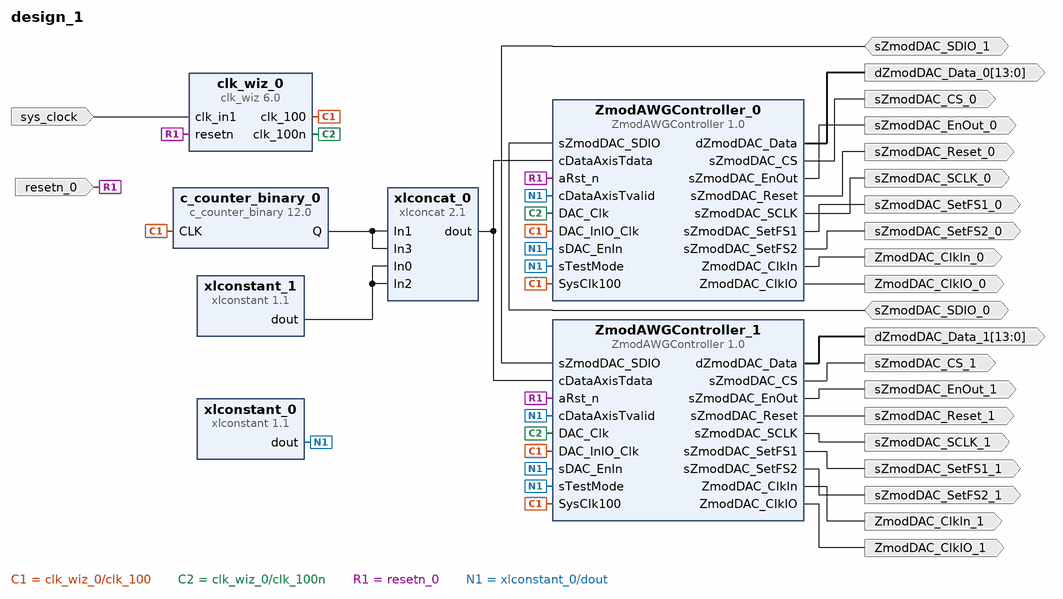
[diagram p0: block diagram of the top level]
# Vivado block design design_1, xc7z020clg484-1, Vivado 2021.2
create_bd_design design_1

create_bd_port -dir O sZmodDAC_SetFS1_0
create_bd_port -dir O -type clk ZmodDAC_ClkIO_0
create_bd_port -dir O -type clk ZmodDAC_ClkIn_0
create_bd_port -dir O -from 13 -to 0 dZmodDAC_Data_0
create_bd_port -dir IO sZmodDAC_SDIO_0
create_bd_port -dir O -type rst sZmodDAC_Reset_0
create_bd_port -dir O sZmodDAC_CS_0
create_bd_port -dir O sZmodDAC_SCLK_0
create_bd_port -dir O sZmodDAC_SetFS2_0
create_bd_port -dir O sZmodDAC_EnOut_0
create_bd_port -dir I -type clk sys_clock
set_property -dict {CONFIG.FREQ_HZ 125000000 CONFIG.PHASE 0.0} [get_bd_ports sys_clock]
create_bd_port -dir O -type clk ZmodDAC_ClkIO_1
create_bd_port -dir O -type clk ZmodDAC_ClkIn_1
create_bd_port -dir O -from 13 -to 0 dZmodDAC_Data_1
create_bd_port -dir O sZmodDAC_CS_1
create_bd_port -dir O sZmodDAC_EnOut_1
create_bd_port -dir O -type rst sZmodDAC_Reset_1
create_bd_port -dir O sZmodDAC_SCLK_1
create_bd_port -dir IO sZmodDAC_SDIO_1
create_bd_port -dir O sZmodDAC_SetFS1_1
create_bd_port -dir O sZmodDAC_SetFS2_1
create_bd_port -dir I -type rst resetn_0

create_bd_cell -type ip -vlnv digilent.com:user:ZmodAWGController:1.0 ZmodAWGController_0
set_property -dict {CONFIG.kCh1ScaleStatic {"1"}} [get_bd_cells ZmodAWGController_0]
create_bd_cell -type ip -vlnv xilinx.com:ip:xlconstant:1.1 xlconstant_0
create_bd_cell -type ip -vlnv xilinx.com:ip:clk_wiz:6.0 clk_wiz_0
set_property -dict [list \
  CONFIG.CLKOUT2_JITTER 124.615 \
  CONFIG.CLKOUT2_PHASE_ERROR 96.948 \
  CONFIG.CLKOUT2_REQUESTED_PHASE 90.000 \
  CONFIG.CLKOUT2_USED true \
  CONFIG.CLK_IN1_BOARD_INTERFACE sys_clock \
  CONFIG.CLK_OUT1_PORT clk_100 \
  CONFIG.CLK_OUT2_PORT clk_100n \
  CONFIG.MMCM_CLKOUT1_DIVIDE 10 \
  CONFIG.MMCM_CLKOUT1_PHASE 90.000 \
  CONFIG.NUM_OUT_CLKS 2 \
  CONFIG.RESET_PORT resetn \
  CONFIG.RESET_TYPE ACTIVE_LOW \
  CONFIG.USE_BOARD_FLOW true \
  CONFIG.USE_LOCKED false \
] [get_bd_cells clk_wiz_0]
create_bd_cell -type ip -vlnv digilent.com:user:ZmodAWGController:1.0 ZmodAWGController_1
set_property -dict {CONFIG.kCh1ScaleStatic {"1"}} [get_bd_cells ZmodAWGController_1]
create_bd_cell -type ip -vlnv xilinx.com:ip:xlconcat:2.1 xlconcat_0
set_property -dict {CONFIG.NUM_PORTS 4} [get_bd_cells xlconcat_0]
create_bd_cell -type ip -vlnv xilinx.com:ip:xlconstant:1.1 xlconstant_1
set_property -dict {CONFIG.CONST_VAL 0 CONFIG.CONST_WIDTH 2} [get_bd_cells xlconstant_1]
create_bd_cell -type ip -vlnv xilinx.com:ip:c_counter_binary:12.0 c_counter_binary_0
set_property -dict {CONFIG.Output_Width 14} [get_bd_cells c_counter_binary_0]

# ---- connections ----

connect_bd_net [get_bd_ports sZmodDAC_SDIO_0] [get_bd_pins ZmodAWGController_0/sZmodDAC_SDIO]
connect_bd_net [get_bd_ports sZmodDAC_SDIO_1] [get_bd_pins ZmodAWGController_1/sZmodDAC_SDIO]
connect_bd_net [get_bd_pins ZmodAWGController_0/ZmodDAC_ClkIO] [get_bd_ports ZmodDAC_ClkIO_0]
connect_bd_net -net ZmodAWGController_0_ZmodDAC_ClkIO1 [get_bd_pins ZmodAWGController_1/ZmodDAC_ClkIO] [get_bd_ports ZmodDAC_ClkIO_1]
connect_bd_net [get_bd_pins ZmodAWGController_0/ZmodDAC_ClkIn] [get_bd_ports ZmodDAC_ClkIn_0]
connect_bd_net -net ZmodAWGController_0_ZmodDAC_ClkIn1 [get_bd_pins ZmodAWGController_1/ZmodDAC_ClkIn] [get_bd_ports ZmodDAC_ClkIn_1]
connect_bd_net [get_bd_pins ZmodAWGController_0/dZmodDAC_Data] [get_bd_ports dZmodDAC_Data_0]
connect_bd_net -net ZmodAWGController_0_dZmodDAC_Data1 [get_bd_pins ZmodAWGController_1/dZmodDAC_Data] [get_bd_ports dZmodDAC_Data_1]
connect_bd_net [get_bd_pins ZmodAWGController_0/sZmodDAC_CS] [get_bd_ports sZmodDAC_CS_0]
connect_bd_net -net ZmodAWGController_0_sZmodDAC_CS1 [get_bd_pins ZmodAWGController_1/sZmodDAC_CS] [get_bd_ports sZmodDAC_CS_1]
connect_bd_net [get_bd_pins ZmodAWGController_0/sZmodDAC_EnOut] [get_bd_ports sZmodDAC_EnOut_0]
connect_bd_net -net ZmodAWGController_0_sZmodDAC_EnOut1 [get_bd_pins ZmodAWGController_1/sZmodDAC_EnOut] [get_bd_ports sZmodDAC_EnOut_1]
connect_bd_net [get_bd_pins ZmodAWGController_0/sZmodDAC_Reset] [get_bd_ports sZmodDAC_Reset_0]
connect_bd_net -net ZmodAWGController_0_sZmodDAC_Reset1 [get_bd_pins ZmodAWGController_1/sZmodDAC_Reset] [get_bd_ports sZmodDAC_Reset_1]
connect_bd_net [get_bd_pins ZmodAWGController_0/sZmodDAC_SCLK] [get_bd_ports sZmodDAC_SCLK_0]
connect_bd_net -net ZmodAWGController_0_sZmodDAC_SCLK1 [get_bd_pins ZmodAWGController_1/sZmodDAC_SCLK] [get_bd_ports sZmodDAC_SCLK_1]
connect_bd_net [get_bd_pins ZmodAWGController_0/sZmodDAC_SetFS1] [get_bd_ports sZmodDAC_SetFS1_0]
connect_bd_net [get_bd_pins ZmodAWGController_0/sZmodDAC_SetFS2] [get_bd_ports sZmodDAC_SetFS2_0]
connect_bd_net -net ZmodAWGController_0_sZmodDAC_SetFS3 [get_bd_pins ZmodAWGController_1/sZmodDAC_SetFS1] [get_bd_ports sZmodDAC_SetFS1_1]
connect_bd_net -net ZmodAWGController_0_sZmodDAC_SetFS4 [get_bd_pins ZmodAWGController_1/sZmodDAC_SetFS2] [get_bd_ports sZmodDAC_SetFS2_1]
connect_bd_net [get_bd_pins c_counter_binary_0/Q] [get_bd_pins xlconcat_0/In1] [get_bd_pins xlconcat_0/In3]
connect_bd_net [get_bd_pins clk_wiz_0/clk_100] \
  [get_bd_pins ZmodAWGController_0/SysClk100] [get_bd_pins ZmodAWGController_0/DAC_InIO_Clk] \
  [get_bd_pins ZmodAWGController_1/SysClk100] [get_bd_pins ZmodAWGController_1/DAC_InIO_Clk] \
  [get_bd_pins c_counter_binary_0/CLK]
connect_bd_net [get_bd_pins clk_wiz_0/clk_100n] [get_bd_pins ZmodAWGController_0/DAC_Clk] [get_bd_pins ZmodAWGController_1/DAC_Clk]
connect_bd_net -net resetn_0_1 [get_bd_ports resetn_0] \
  [get_bd_pins clk_wiz_0/resetn] [get_bd_pins ZmodAWGController_1/aRst_n] [get_bd_pins ZmodAWGController_0/aRst_n]
connect_bd_net [get_bd_ports sys_clock] [get_bd_pins clk_wiz_0/clk_in1]
connect_bd_net [get_bd_pins xlconcat_0/dout] [get_bd_pins ZmodAWGController_1/cDataAxisTdata] [get_bd_pins ZmodAWGController_0/cDataAxisTdata]
connect_bd_net [get_bd_pins xlconstant_0/dout] \
  [get_bd_pins ZmodAWGController_0/sDAC_EnIn] [get_bd_pins ZmodAWGController_0/sTestMode] \
  [get_bd_pins ZmodAWGController_1/sDAC_EnIn] [get_bd_pins ZmodAWGController_1/sTestMode] \
  [get_bd_pins ZmodAWGController_1/cDataAxisTvalid] [get_bd_pins ZmodAWGController_0/cDataAxisTvalid]
connect_bd_net [get_bd_pins xlconstant_1/dout] [get_bd_pins xlconcat_0/In0] [get_bd_pins xlconcat_0/In2]

validate_bd_design
save_bd_design
